# Altium schematic sheet Schematic.SchDoc
size A
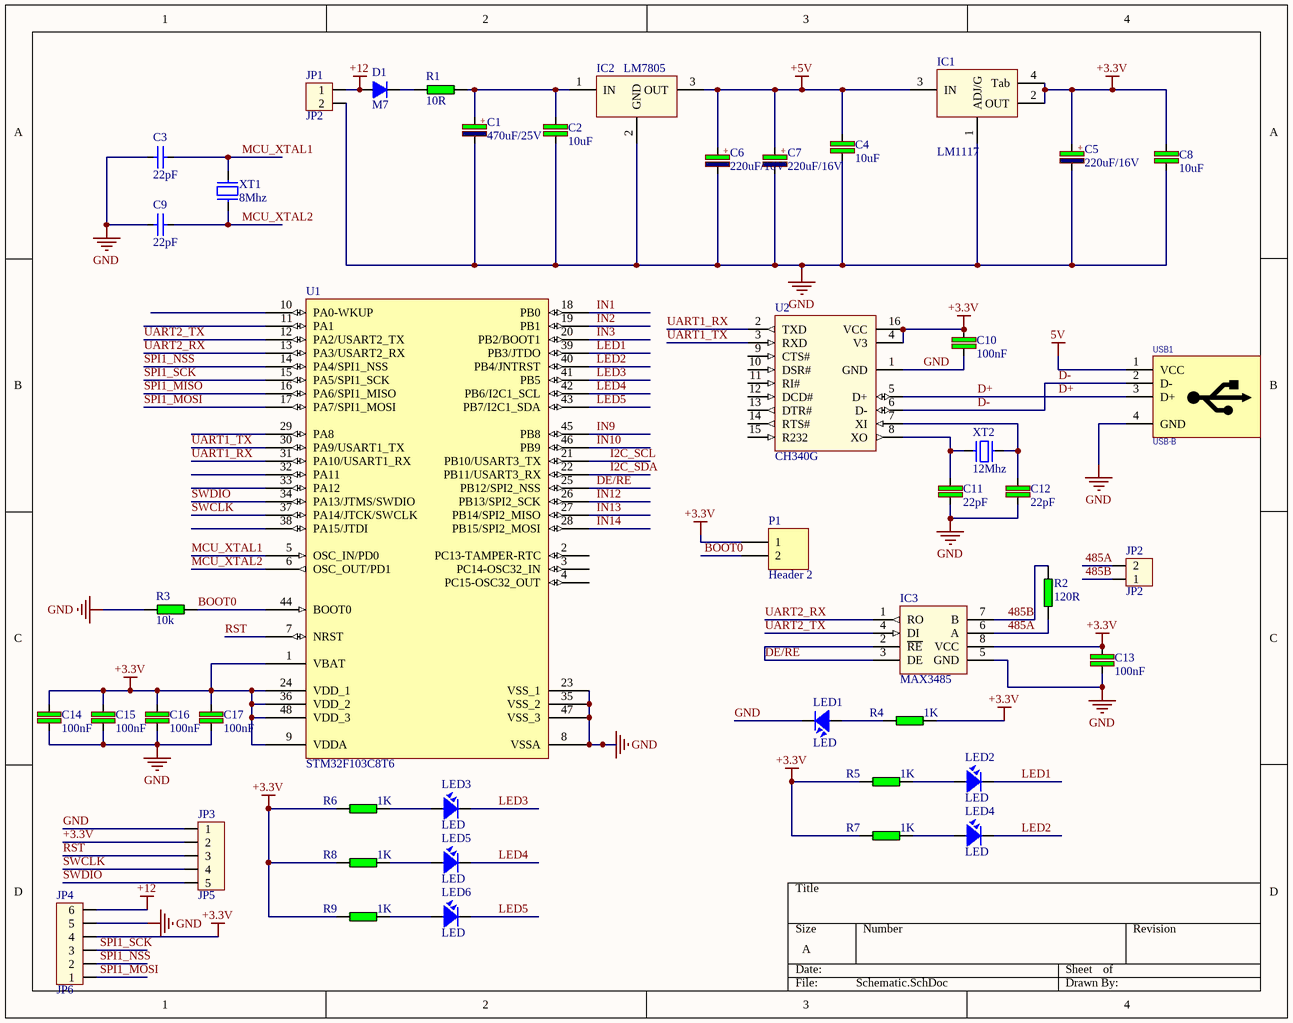
[diagram p0: Schematic.SchDoc]

## Parts
C1  470uF/25V  [CP_1000UF/25V_NAM - cao]
C2  10uF  [C-0805]
C3  22pF  [CAP_0805]
C4  10uF  [C-0805]
C5  220uF/16V  [CA-ALU-5L]
C6  220uF/16V  [CA-ALU-5L]
C7  220uF/16V  [CA-ALU-5L]
C8  10uF  [C-0805]
C9  22pF  [CAP_0805]
C10  100nF  [C-0805]
C11  22pF  [C-0805]
C12  22pF  [C-0805]
C13  100nF  [C-0805]
C14  100nF  [C-0805]
C15  100nF  [C-0805]
C16  100nF  [C-0805]
C17  100nF  [C-0805]
D1  M7  [SMA11]
IC1  LM1117  [SOT223-4N]
IC2  LM7805  [TO-252 7805]
IC3  MAX3485  [SOIC-8]
JP1  JP2  [KF2-5.08T]
JP2  JP2  [KF2-5.08T]
JP3  JP5  [JP5-D1T]
JP4  JP6  [CON6]
LED1  LED  [LED-0805-Red]
LED2  LED  [LED-0805-Red]
LED3  LED  [LED-3]
LED4  LED  [LED-0805-Red]
LED5  LED  [LED-3]
LED6  LED  [LED-3]
P1  Header 2  [HDR1X2]
R1  10R  [R-1206]
R2  120R  [R-0805]
R3  10k  [R-0805]
R4  1K  [R-0805]
R5  1K  [R-0805]
R6  1K  [R-0805]
R7  1K  [R-0805]
R8  1K  [R-0805]
R9  1K  [R-0805]
U1  STM32F103C8T6  [LQFP48_L]
U2  CH340G  [SOIC-16]
USB1  USB-B  [USB-B]
XT1  8Mhz  [XTAL-RU49/4]
XT2  12Mhz  [XTAL-RU49/4]

## Nets
5V: USB1.1(VCC)
+3.3V: C5.1 C8.2 C10.2 C13.1 C14.1 C15.1 C16.1 C17.1 IC1.2(OUT) IC1.4(Tab) IC3.8(VCC) JP3.2 JP4.4 P1.1 R4.1 R5.2 R6.2 R7.2 R8.2 R9.2 U1.1(VBAT) U1.9(VDDA) U1.24(VDD_1) U1.36(VDD_2) U1.48(VDD_3) U2.4(V3) U2.16(VCC)
+5V: C4.2 C6.1 C7.1 IC1.3(IN) IC2.3(OUT)
+12: D1.1(A) JP1.1 JP4.6
GND: C1.2 C2.1 C3.2 C4.1 C5.2 C6.2 C7.2 C8.1 C9.2 C10.1 C11.1 C12.1 C13.2 C14.2 C15.2 C16.2 C17.2 IC1.1(ADJ/G) IC2.2(GND) IC3.5(GND) JP1.2 JP3.1 JP4.5 LED1.2 R3.1 U1.8(VSSA) U1.23(VSS_1) U1.35(VSS_2) U1.47(VSS_3) U2.1(GND) USB1.4(GND)
485A: IC3.6(A) JP2.2 R2.2
485B: IC3.7(B) JP2.1 R2.1
BOOT0: P1.2 R3.2 U1.44(BOOT0)
D+: U2.5(D+) USB1.3(D+)
D-: U2.6(D-) USB1.2(D-)
DE/RE: IC3.2(~{RE}) IC3.3(DE) U1.25(PB12/SPI2_NSS)
I2C_SCL: U1.21(PB10/USART3_TX)
I2C_SDA: U1.22(PB11/USART3_RX)
IN1: U1.18(PB0)
IN2: U1.19(PB1)
IN3: U1.20(PB2/BOOT1)
IN9: U1.45(PB8)
IN10: U1.46(PB9)
IN12: U1.26(PB13/SPI2_SCK)
IN13: U1.27(PB14/SPI2_MISO)
IN14: U1.28(PB15/SPI2_MOSI)
LED1: LED2.2 U1.39(PB3/JTDO)
LED2: LED4.2 U1.40(PB4/JNTRST)
LED3: LED3.2 U1.41(PB5)
LED4: LED5.2 U1.42(PB6/I2C1_SCL)
LED5: LED6.2 U1.43(PB7/I2C1_SDA)
MCU_XTAL1: C3.1 U1.5(OSC_IN/PD0) XT1.1
MCU_XTAL2: C9.1 U1.6(OSC_OUT/PD1) XT1.2
RST: JP3.3 U1.7(NRST)
SPI1_MISO: U1.16(PA6/SPI1_MISO)
SPI1_MOSI: JP4.1 U1.17(PA7/SPI1_MOSI)
SPI1_NSS: JP4.2 U1.14(PA4/SPI1_NSS)
SPI1_SCK: JP4.3 U1.15(PA5/SPI1_SCK)
SWCLK: JP3.4 U1.37(PA14/JTCK/SWCLK)
SWDIO: JP3.5 U1.34(PA13/JTMS/SWDIO)
UART1_RX: U1.31(PA10/USART1_RX) U2.2(TXD)
UART1_TX: U1.30(PA9/USART1_TX) U2.3(RXD)
UART2_RX: IC3.1(RO) U1.13(PA3/USART2_RX)
UART2_TX: IC3.4(DI) U1.12(PA2/USART2_TX)
NetC1_1: C1.1 C2.2 IC2.1(IN) R1.2
NetC11_2: C11.2 U2.8(XO) XT2.1
NetC12_2: C12.2 U2.7(XI) XT2.2
NetD1_2: D1.2(K) R1.1
NetLED1_1: LED1.1 R4.2
NetLED2_1: LED2.1 R5.1
NetLED3_1: LED3.1 R6.1
NetLED4_1: LED4.1 R7.1
NetLED5_1: LED5.1 R8.1
NetLED6_1: LED6.1 R9.1

Not connected (* = marked no-connect by the designer): U1 2(PC13-TAMPER-RTC) 3(PC14-OSC32_IN) 4(PC15-OSC32_OUT) 10(PA0-WKUP) 11(PA1) 29(PA8) 32(PA11) 33(PA12) 38(PA15/JTDI); U2 9(CTS#) 10(DSR#) 11(RI#) 12(DCD#) 13(DTR#) 14(RTS#) 15(R232)

## Notes on the sheet
- (in symbol CP3) +
- (in symbol CP4) +

## Library data of the parts
C1 = CP4: 470uF/35V; Manufacturer: Würth Elektronik; Part number: 860020575014; Value: 470uF; User_Description: CAP ALUM 470UF 20% 35V RADIAL; Category: CAPACITOR
C2 C4 C8 C14-C17 = C: Cap SMD; Value: 103
C3 C9 = CapSMD: Capacitor; Value: 33p; Published: 8-Jun-2000; LatestRevisionDate: 17-Jul-2002; LatestRevisionNote: Re-released for DXP Platform.; PackageReference: RAD-0.3; Publisher: Altium Limited
C5-C7 = CP3: Cap 100uF/35V - 470uF/16V; Value: 100uF/35V/50V; Description 1: 1000uF/6,3V - 470uF/16V - 330uF - 25V; Description 2: 220uF/35V - 100uF/50V - 63V - 4,7uF/200V; Description 3: 22uF => 33uF100V - 3,3uF => 4,7uF/250V; Description 4: 2,2uF =>3,3uF/350 - 2,2uF/400V - 1uF/450V
C10 C13 = C: Cap SMD; Manufacturer: Samsung Electro-Mechanics; Part number: CL21B104KBCNNWC; User_Description: CAP CER 0.1UF 50V X7R 0805; Value: 100nF; Category: CAPACITOR; Package: 0805
C11 C12 = C: Cap SMD; Manufacturer: Samsung Electro-Mechanics; Part number: CL21C220JBANFNC; User_Description: CAP CER 22PF 50V C0G/NP0 0805; Value: 22pF; Category: CAPACITOR; Package: 0805
D1 = D1A: Diode 1A; Value: 1N4007
IC1 = LM1117: 3v3; Value: LM317
IC2 = LM78xx: On ap +, from + 5 to + 24VDC; Value: LM7805
IC3 = MAX3362EKA+T: IC TRANSCEIVER HALF 1/1 SOT23-8; Manufacturer: Maxim Integrated; Category: Interface - Drivers; Package: SOT-23-8; User_Description: IC TRANSCEIVER HALF 1/1 SOT23-8; Part number: MAX3362EKA+T
JP1 JP2 = Con2: Connector 2; Value: Connector 2
JP3 = Con5: Connector 5; Value: Connector 5
JP4 = Con6: Connector 6; Value: Connector 6
LED1-LED6 = LED: LED Single colour Green and Red; Value: LED 3 ly Single Colour
P1 = Header 2: Header, 2-Pin; LatestRevisionDate: 17-Jul-2002; LatestRevisionNote: Re-released for DXP Platform.; Publisher: Altium Limited
R1-R9 = RES: Resistor 1/4W; Value: R1/4W - 1K
U2 = CH340G: USB to UART Interface; Manufacturer: WCH; Category: IC UART Interface; Package: SOIC-16; Part number: CH340G; User_Description: USB to UART Interface
USB1 = USB-B: CONN USB 2.0 RT ANGLE TYPE B; Manufacturer: Stewart Connector; Part number: SS-52300-001; Category: Connectors, Interconnects; Package: Through Hole; User_Description: CONN USB 2.0 RT ANGLE TYPE B
XT1 = XT2: CRYSTAL 12.0000MHZ 18PF SMD; Manufacturer: IQD Frequency Products; Part number: LFXTAL036356REEL; Value: 12Mhz; Category: Crystals; Package: HC-49/US; User_Description: CRYSTAL 12.0000MHZ 18PF SMD
XT2 = XT2: CRYSTAL 12.0000MHZ 18PF SMD; Manufacturer: IQD Frequency Products; Part number: LFXTAL036356REEL; Value: 12Mhz; Category: Crystals; Package: HC-49/US; User_Description: CRYSTAL 12.0000MHZ 18PF SMD